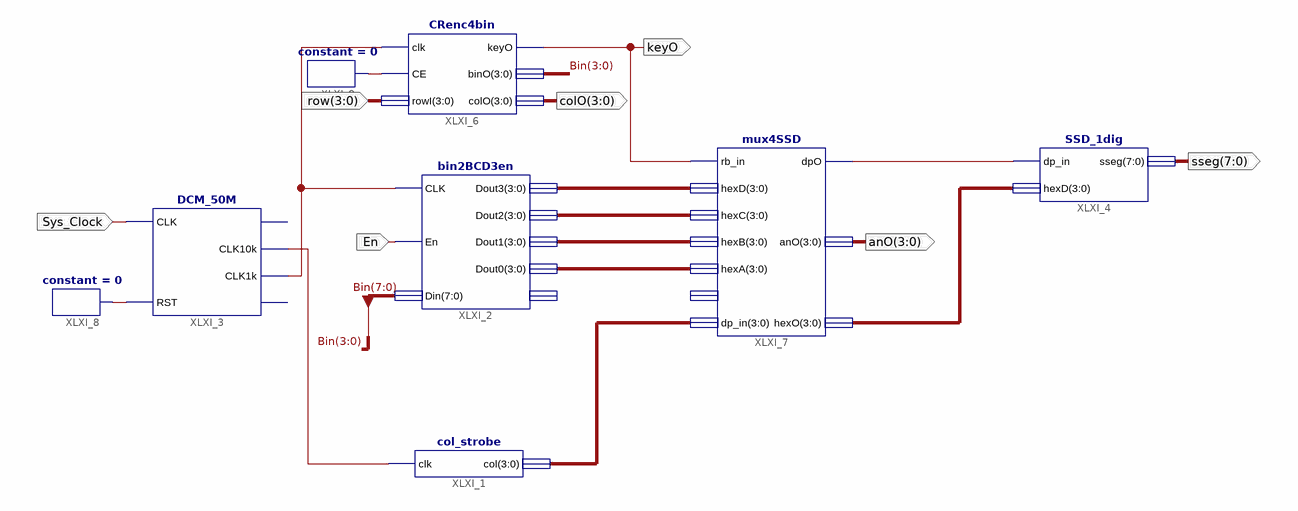
[diagram p0: schematic sheet 1]
// Xilinx ISE schematic Ex4.sch (spartan3e) as structural Verilog: 8 symbols, 8 ports
module Ex4 (
  input  Sys_Clock,
  input  En,
  input  [3:0] row,
  output [3:0] abc,
  output keyO,
  output [3:0] anO,
  output [7:0] sseg,
  output [3:0] colO
);

  wire XLXN_2, XLXN_4, XLXN_5, XLXN_26, XLXN_32;
  wire [3:0] XLXN_6, XLXN_7, XLXN_8, XLXN_9, XLXN_25;
  wire [7:0] Bin;

  col_strobe XLXI_1 (.clk(XLXN_5), .col(abc));
  bin2BCD3en XLXI_2 (
    .CLK(XLXN_4), .En(En), .Din(Bin), .Dout3(XLXN_6), .Dout2(XLXN_7), .Dout1(XLXN_8), .Dout0(XLXN_9));  // open: RBout
  DCM_50M XLXI_3 (.CLK(Sys_Clock), .RST(XLXN_2), .CLK10k(XLXN_5), .CLK1k(XLXN_4));  // open: CLK1M, CLK1
  SSD_1dig XLXI_4 (.dp_in(XLXN_26), .hexD(XLXN_25), .sseg(sseg));
  CRenc4bin XLXI_6 (.clk(XLXN_4), .CE(XLXN_32), .rowI(row), .keyO(keyO), .binO(Bin[3:0]), .colO(colO));
  mux4SSD XLXI_7 (
    .rb_in(keyO), .hexD(XLXN_6), .hexC(XLXN_7), .hexB(XLXN_8), .hexA(XLXN_9), .dp_in(abc), .dpO(XLXN_26),
    .anO(anO), .hexO(XLXN_25));  // open: sel
  constant #(.CValue("0")) XLXI_8 (.O(XLXN_2));
  constant #(.CValue("0")) XLXI_9 (.O(XLXN_32));
endmodule
